# EAGLE design V02 (EAGLE 7.1.0)
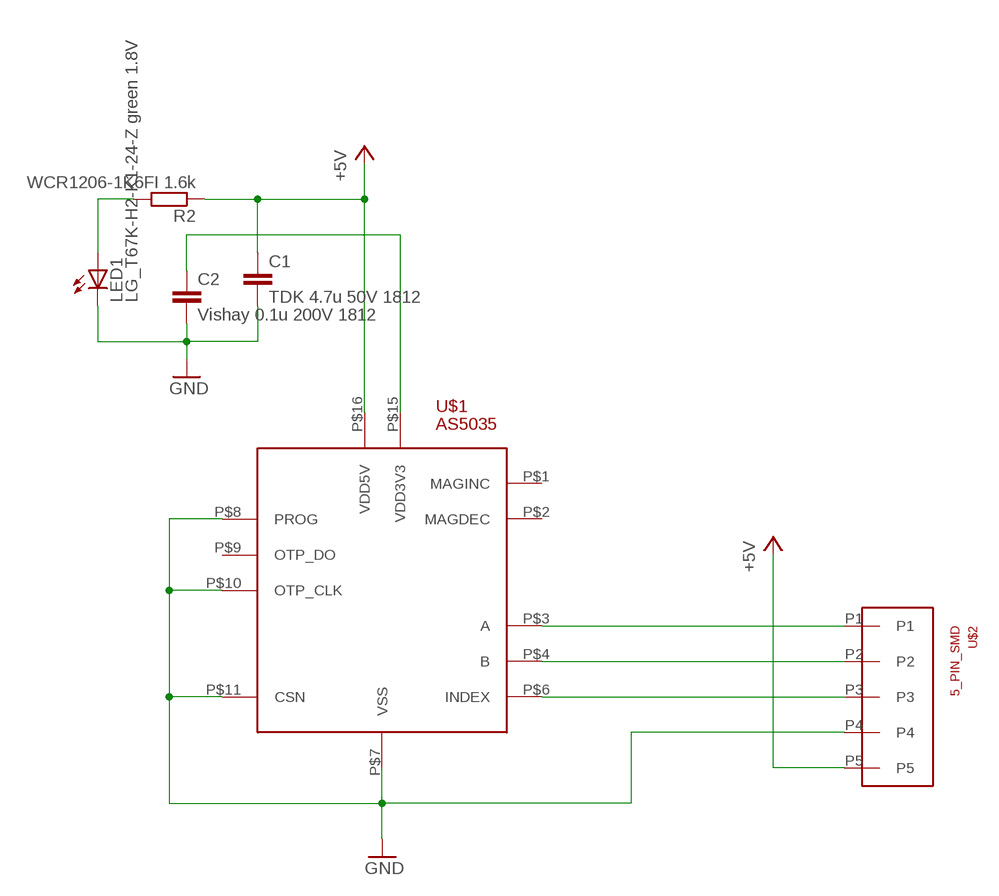
[diagram p0: schematic, sheet 1]

## Parts
C1  TDK 4.7u 50V 1812  C-EUC1812K  [C1812K]
C2  Vishay 0.1u 200V 1812  C-EUC1812K  [C1812K]
LED1  LG_T67K-H2-K1-24-Z green 1.8V  LG_T679-E1F1-1  [PLCC2]
R2  WCR1206-1K6FI 1.6k  R-EU_R1206  [R1206]
U$1  AS5035  [TSSOP-16]
U$2  5_PIN_SMD  [5_PIN_SMD]

## Nets
+5V: C1.1 R2.1 U$1.P$16(VDD5V) U$2.P5
GND: C1.2 C2.2 LED1.C U$1.P$7(VSS) U$1.P$8(PROG) U$1.P$10(OTP_CLK) U$1.P$11(CSN) U$2.P4
N$1: C2.1 U$1.P$15(VDD3V3)
N$6: LED1.A R2.2
N$7: U$1.P$4(B) U$2.P2
N$8: U$1.P$3(A) U$2.P1
N$9: U$1.P$6(INDEX) U$2.P3
Unconnected: U$1.P$1(MAGINC) U$1.P$2(MAGDEC) U$1.P$9(OTP_DO)

## Library data of the parts
C1 C2 = rcl:C-EU: CAPACITOR, European symbol
LED1 = led:*_T679-?-1: LC TOPLED® Low Current LED Source: http://catalog.osram-os.com .. LG_LS_LY_T679_OBS.pdf; COLOR: green
R2 = rcl:R-EU_: RESISTOR, European symbol
U$1 = keysie:AS5035
U$2 = keysie:5_PIN_SMD

## Board
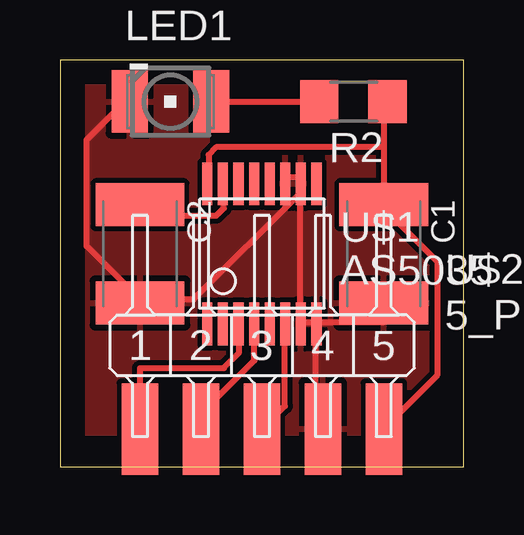
[diagram p1: board, top side]

Size 16.82 x 16.98 mm. Coordinates in mm from the lower left corner, seen from the top.
Outline: 0,0 16.81,0 16.81,16.98 0,16.98 0,0
Copper layers (1*16): Top 0.035mm / dielectric 1.5mm / Bottom 0.035mm
Design rules "default": minimum track width 10mil, minimum drill 24mil, track to track 8mil, track to pad 8mil, pad to pad 8mil, via to via 8mil, smd to smd 8mil, copper to edge 40mil, drill to drill 8mil, minimum pad ring 10mil, minimum via ring 8mil, stop-mask expansion 4mil, vias tented up to drill 0mil, thermal gap 10mil

### Footprints (pad centres in the part's own frame; a part is rotated, then mirrored left to right if it is on the bottom)
C1812K = smd 1.8 x 3.7: 1 -2.05,0; 2 2.05,0
PLCC2 = smd 2.6 x 1.5: A 0,1.7; C 0,-1.7
R1206 = smd 1.6 x 1.803: 1 -1.422,0; 2 1.422,0
TSSOP-16 = smd 0.42 x 1.78: P$1 -2.275,-2.925; P$2 -1.625,-2.925; P$3 -0.975,-2.925; P$4 -0.325,-2.925; P$5 0.325,-2.925; P$6 0.975,-2.925; P$7 1.625,-2.925; P$8 2.275,-2.925; P$9 2.275,2.925; P$10 1.625,2.925; P$11 0.975,2.925; P$12 0.325,2.925; P$13 -0.325,2.925; P$14 -0.975,2.925; P$15 -1.625,2.925; P$16 -2.275,2.925
5_PIN_SMD = smd 1.524 x 3.81: P1 -5.08,-3.493; P2 -2.54,-3.493; P3 0,-3.493; P4 2.54,-3.493; P5 5.08,-3.493

### Placement (x,y rotation side)
C1  13.49,8.89 270 top
C2  3.33,8.89 270 top
LED1  4.6,15.24 270 top
R2  12.22,15.24 180 top
U$1  8.41,8.89 0 top
U$2  8.41,5.08 0 top

### Tracks (layer width: path | path; a pad name or v marks a point on that pad's centre or on a via)
+5V
  Top 0.254: 13.49,13.34 6.51,13.34 6.19,13.02 6.19,12.06 U$1.P$16 | 13.49,13.34 13.49,15.24 R2.1 | 13.49,13.34 C1.1 13.49,10.79 15.72,8.57 15.72,3.81 U$2.P5
GND
  Top 0.254: 3.33,6.99 1.11,9.21 1.11,13.65 2.7,15.24 LED1.C | U$1.P$11 9.37,12.06 10,12.06 U$1.P$10 | 10.64,6.03 10,6.03 | 10.64,6.03 13.49,6.03 C1.2 | 10.64,6.03 U$1.P$8 10.64,5.71 10.64,1.91 U$2.P4 | 10,6.03 10,11.43 | 10,11.43 10,11.75 U$1.P$10 | 10,6.03 U$1.P$7 | 3.33,6.99 5.56,6.99 10,11.43 | 3.33,6.99 C2.2 | 10,11.43 U$1.P$10
  pour Top: 0,17.62 17.14,17.62 17.14,1.43 0,1.43
N$1
  Top 0.254: C2.1 3.33,10.48 6.51,10.48 6.83,10.79 6.83,11.75 U$1.P$15
N$6
  Top 0.254: LED1.A R2.2
N$7
  Top 0.254: U$2.P2 5.87,2.22 8.1,4.45 8.1,5.71 U$1.P$4
N$8
  Top 0.254: U$2.P1 3.33,4.13 6.83,4.13 7.46,4.76 7.46,5.71 U$1.P$3
N$9
  Top 0.254: U$2.P3 9.37,2.54 9.37,5.71 U$1.P$6